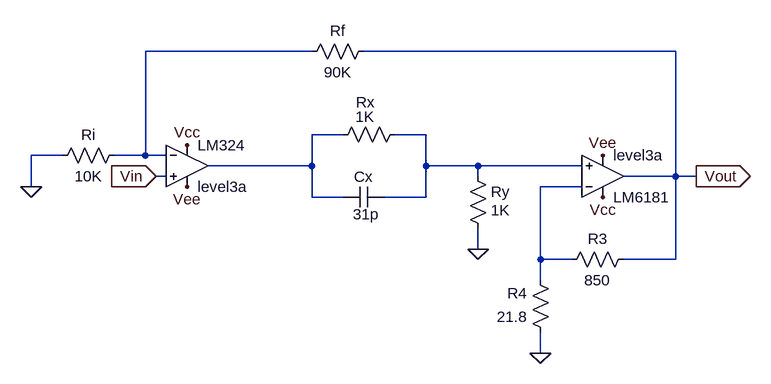
[diagram p0: schematic Draft1.asc]
Draft1.asc, the LTspice schematic file:
Version 4.1
SHEET 1 880 680
WIRE 128 -16 -128 -16
WIRE 688 -16 208 -16
WIRE 176 112 128 112
WIRE 304 112 256 112
WIRE -256 144 -304 144
WIRE -128 144 -128 -16
WIRE -128 144 -176 144
WIRE -96 144 -128 144
WIRE 128 160 128 112
WIRE 128 160 -32 160
WIRE 304 160 304 112
WIRE 384 160 304 160
WIRE 544 160 384 160
WIRE -96 176 -112 176
WIRE 384 176 384 160
WIRE 688 176 688 -16
WIRE 688 176 608 176
WIRE 720 176 688 176
WIRE -304 192 -304 144
WIRE 544 192 480 192
WIRE 128 208 128 160
WIRE 176 208 128 208
WIRE 304 208 304 160
WIRE 304 208 240 208
WIRE 384 288 384 256
WIRE 480 304 480 192
WIRE 528 304 480 304
WIRE 688 304 688 176
WIRE 688 304 608 304
WIRE 480 336 480 304
WIRE 480 448 480 416
FLAG 384 288 0
FLAG 480 448 0
FLAG -304 192 0
FLAG -64 128 Vcc
FLAG 576 208 Vcc
FLAG -64 192 Vee
FLAG 576 144 Vee
FLAG -112 176 Vin
IOPIN -112 176 In
FLAG 720 176 Vout
IOPIN 720 176 Out
SYMBOL res 368 160 R0
WINDOW 3 36 68 Left 2
SYMATTR InstName Ry
SYMATTR Value 1K
SYMBOL res 272 96 R90
WINDOW 0 -18 61 VBottom 2
WINDOW 3 4 62 VBottom 2
SYMATTR InstName Rx
SYMATTR Value 1K
SYMBOL cap 240 192 R90
WINDOW 0 0 32 VBottom 2
WINDOW 3 58 28 VBottom 2
SYMATTR InstName Cx
SYMATTR Value 31p
SYMBOL OpAmps\\UniversalOpAmp3 -64 160 R0
SYMATTR InstName LM324
SYMBOL OpAmps\\UniversalOpAmp3 576 176 M180
SYMATTR InstName LM6181
SYMBOL res -160 128 R90
WINDOW 0 0 56 VBottom 2
WINDOW 3 32 56 VTop 2
SYMATTR InstName Ri
SYMATTR Value 10K
SYMBOL res 224 -32 R90
WINDOW 0 0 56 VBottom 2
WINDOW 3 32 56 VTop 2
SYMATTR InstName Rf
SYMATTR Value 90K
SYMBOL res 624 288 R90
WINDOW 0 0 56 VBottom 2
WINDOW 3 32 56 VTop 2
SYMATTR InstName R3
SYMATTR Value 850
SYMBOL res 496 432 R180
WINDOW 0 36 76 Left 2
WINDOW 3 36 40 Left 2
SYMATTR InstName R4
SYMATTR Value 21.8

The netlist it stands for:
* Draft1.asc
Ry N003 0 1K
Rx N003 N002 1K
Cx N003 N002 31p
X§LM324 Vin N001 Vcc Vee N002 level3a  ; pins In+ In- V+ V- OUT
X§LM6181 N003 N004 Vcc Vee Vout level3a  ; pins In+ In- V+ V- OUT
Ri N001 0 10K
Rf Vout N001 90K
R3 Vout N004 850
R4 0 N004 21.8
.backanno
.end